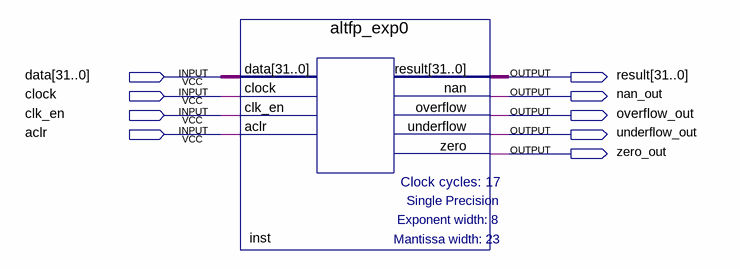
[diagram p0: schematic sheet]
// Quartus schematic lab_11_1.bdf as structural Verilog: 1 symbols, 9 pins
module lab_11_1 (
  input  [31:0] data,
  input  clock,
  input  clk_en,
  input  aclr,
  output [31:0] result,
  output nan_out,
  output overflow_out,
  output underflow_out,
  output zero_out
);

  altfp_exp0 inst (
    .data(data), .clock(clock), .clk_en(clk_en), .aclr(aclr), .result(result), .nan(nan_out),
    .overflow(overflow_out), .underflow(underflow_out), .zero(zero_out));
endmodule
